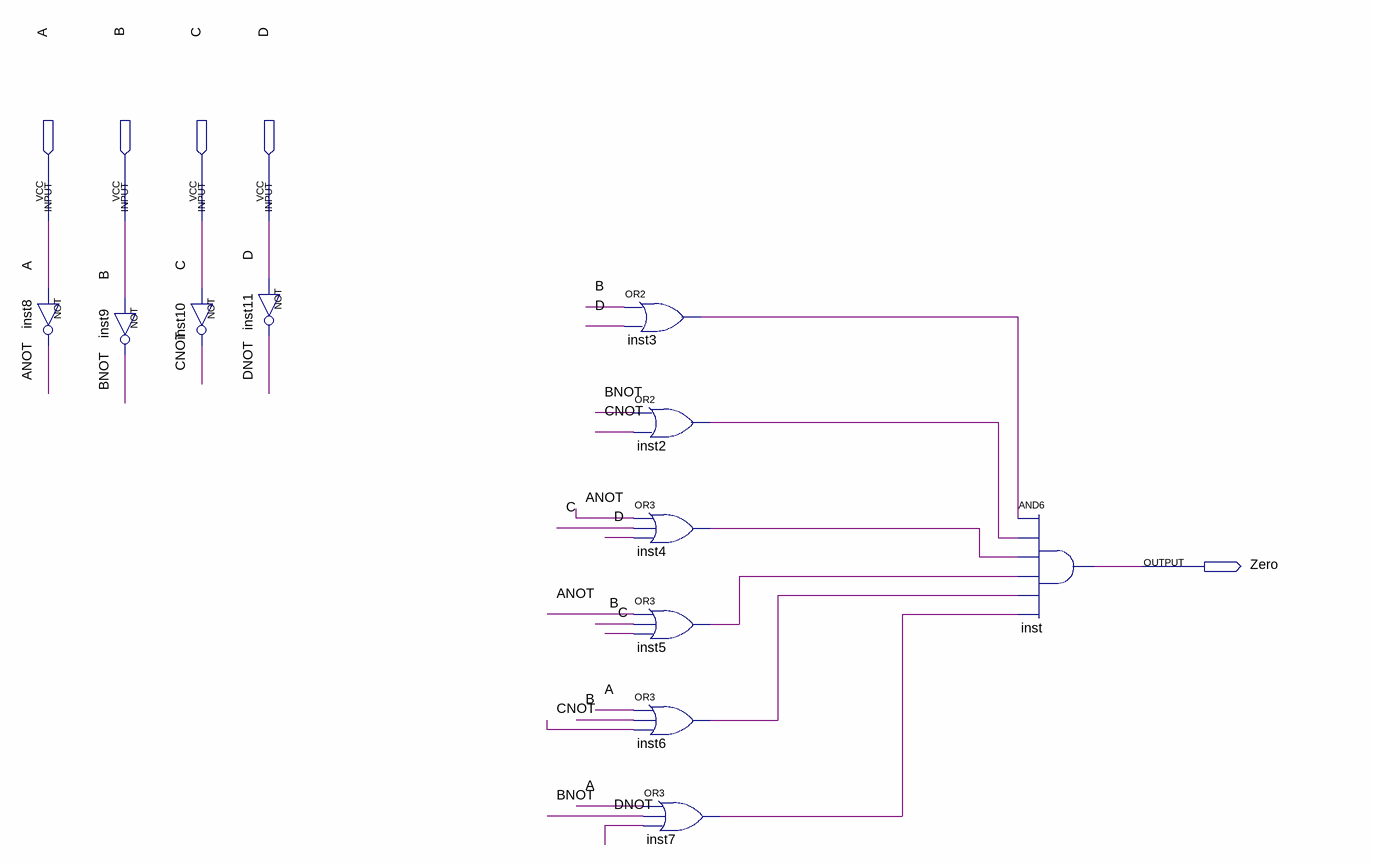
[diagram p0: schematic sheet]
// Quartus schematic Lab03Task02.bdf as structural Verilog: 11 symbols, 5 pins
module Lab03Task02 (
  input  A,
  input  B,
  input  C,
  input  D,
  output Zero
);

  wire ANOT, BNOT, CNOT, DNOT, inst2_out, inst3_out, inst4_out, inst5_out, inst6_out, inst7_out;

  not inst8 (ANOT, A);
  not inst9 (BNOT, B);
  not inst11 (DNOT, D);
  not inst10 (CNOT, C);
  or inst3 (inst3_out, B, D);
  or inst2 (inst2_out, BNOT, CNOT);
  or inst4 (inst4_out, ANOT, C, D);
  or inst5 (inst5_out, ANOT, B, C);
  or inst6 (inst6_out, A, B, CNOT);
  or inst7 (inst7_out, A, BNOT, DNOT);
  and inst (Zero, inst3_out, inst2_out, inst4_out, inst5_out, inst6_out, inst7_out);
endmodule
